# EAGLE design EM7180+LSM6DSM+LIS2MDL+LPS22HD.v01a (EAGLE 7.7.0)
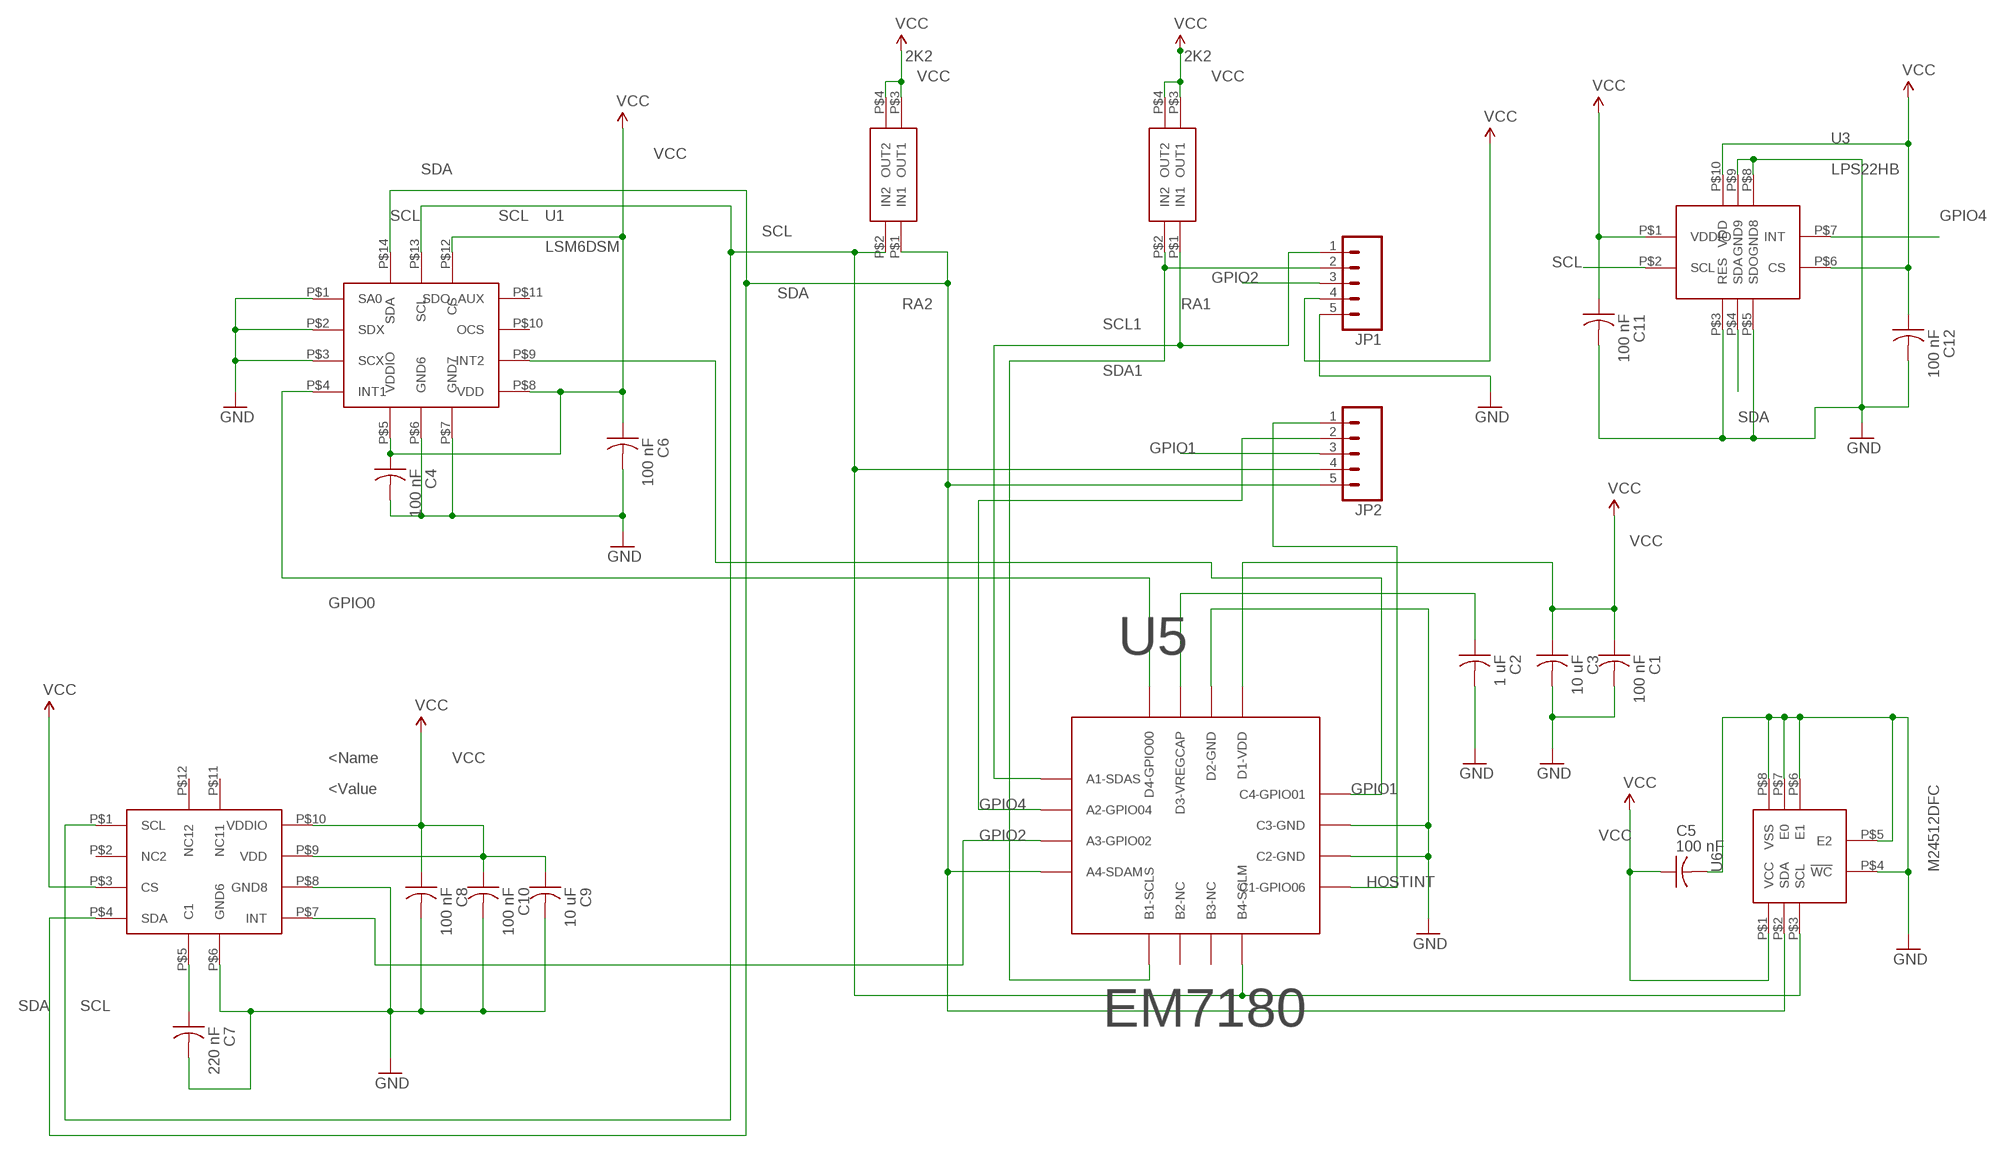
[diagram p0: schematic, sheet 1]

## Parts
C1  100 nF  C-US  [C0402_B]
C2  1 uF  C-US  [C0402_B]
C3  10 uF  C-US  [C0402_B]
C4  100 nF  C-US  [C0402_B]
C5  100 nF  C-US  [C0402_B]
C6  100 nF  C-US  [C0402_B]
C7  220 nF  C-US  [C0402_B]
C8  100 nF  C-US  [C0402_B]
C9  10 uF  C-US  [C0402_B]
C10  100 nF  C-US  [C0402_B]
C11  100 nF  C-US  [C0402_B]
C12  100 nF  C-US  [C0402_B]
JP1  M05NO_SILK  [1X05_NO_SILK]
JP2  M05NO_SILK  [1X05_NO_SILK]
RA1  2K2  EXB24V  [EXB24V]
RA2  2K2  EXB24V  [EXB24V]
U1  LSM6DSM  [LSM6DSM]
U2  LIS2MDL  [LIS2MDL]
U3  LPS22HB  [LPS22HB]
U5  EM7180  [WL-CSP16]
U6  M24512DFC  [M24512DFC]

## Nets
GND: C1.2 C2.2 C3.2 C4.2 C5.2 C6.2 C7.2 C8.2 C9.2 C10.2 C11.2 C12.2 JP1.5 U1.P$1(SA0) U1.P$2(SDX) U1.P$3(SCX) U1.P$6(GND6) U1.P$7(GND7) U2.P$6(GND6) U2.P$8(GND8) U3.P$3(RES) U3.P$5(SDO) U3.P$8(GND8) U3.P$9(GND9) U5.P$10(C2-GND) U5.P$11(C3-GND) U5.P$14(D2-GND) U6.P$4(!WC) U6.P$5(E2) U6.P$6(E1) U6.P$7(E0) U6.P$8(VSS)
GPIO0: U1.P$4(INT1) U5.P$16(D4-GPIO00)
GPIO1: JP2.3 U1.P$9(INT2) U5.P$12(C4-GPIO01)
GPIO2: JP1.3 U2.P$7(INT) U5.P$3(A3-GPIO02)
GPIO4: JP2.2 U3.P$7(INT) U5.P$2(A2-GPIO04)
HOSTINT: JP2.1 U5.P$9(C1-GPIO06)
N$4: C7.1 U2.P$5(C1)
N$9: C2.1 U5.P$15(D3-VREGCAP)
SCL: JP2.4 RA2.P$2(IN2) U1.P$13(SCL) U2.P$1(SCL) U3.P$2(SCL) U5.P$8(B4-SCLM) U6.P$3(SCL)
SCL1: JP1.1 RA1.P$1(IN1) U5.P$1(A1-SDAS)
SDA: JP2.5 RA2.P$1(IN1) U1.P$14(SDA) U2.P$4(SDA) U3.P$4(SDA) U5.P$4(A4-SDAM) U6.P$2(SDA)
SDA1: JP1.2 RA1.P$2(IN2) U5.P$5(B1-SCLS)
VCC: C1.1 C3.1 C4.1 C5.1 C6.1 C8.1 C9.1 C10.1 C11.1 C12.1 JP1.4 RA1.P$3(OUT1) RA1.P$4(OUT2) RA2.P$3(OUT1) RA2.P$4(OUT2) U1.P$5(VDDIO) U1.P$8(VDD) U1.P$12(CS) U2.P$3(CS) U2.P$9(VDD) U2.P$10(VDDIO) U3.P$1(VDDIO) U3.P$6(CS) U3.P$10(VDD) U5.P$13(D1-VDD) U6.P$1(VCC)
Unconnected: U2.P$2(NC2) U2.P$11(NC11) U2.P$12(NC12) U5.P$6(B2-NC) U5.P$7(B3-NC)

## Power pins joined to a net without a drawn wire
OCS: U1.P$10(OCS)
SDO_AUX: U1.P$11(SDO_AUX)

## Library data of the parts
C1-C12 = Spark:C-US: Capacitor
JP1 JP2 = SparkFun-Connectors:M05: Header 5 Standard 5-pin 0.1" header. Use with straight break away headers (SKU : PRT-00116), right angle break away headers (PRT-00553), swiss pins (PRT-00743), machine pins (PRT-00117), and female headers (PRT-00115). Molex polarized connector foot print use with SKU : PRT-08230 with associated crimp pins and housings.
RA1 RA2 = Kris:EXB24V: Panasonic EXB24 22 Ohm series resistor pair
U1 = Kris:LSM6DSM: LSM6DSM ST accel/gyro
U2 = Kris:LIS2MDL: LIS2MDL ST magnetomneter
U3 = Kris:LPS22HB: LPS22HB ST pressure sensor http://www.st.com/content/ccc/resource/technical/document/datasheet/bf/c1/4f/23/61/17/44/8a/DM00140895.pdf/files/DM00140895.pdf/jcr:content/translations/en.DM00140895.pdf
U5 = SparkFun-DigitalIC:EM7180: WL-CSP19 package for the EM7180 SENtral sensor fusion hub
U6 = Kris:M24512DFC: ST's M24512DFC6 512 Mbit EEPROM

## Board
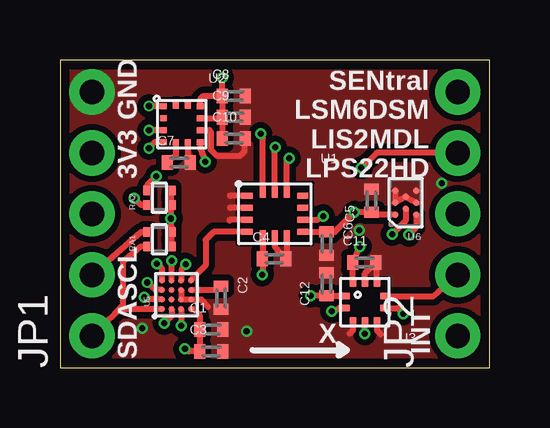
[diagram p1: board, top side]
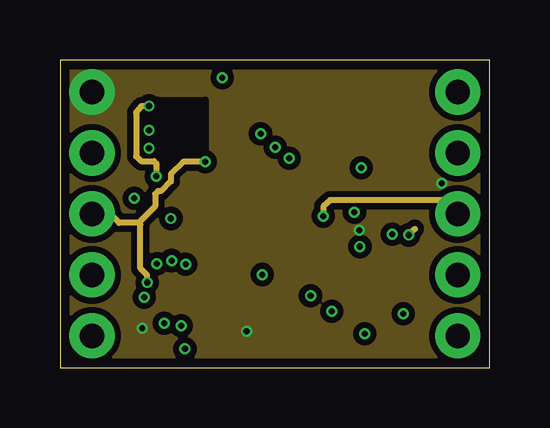
[diagram p2: board, inner layer Route2]
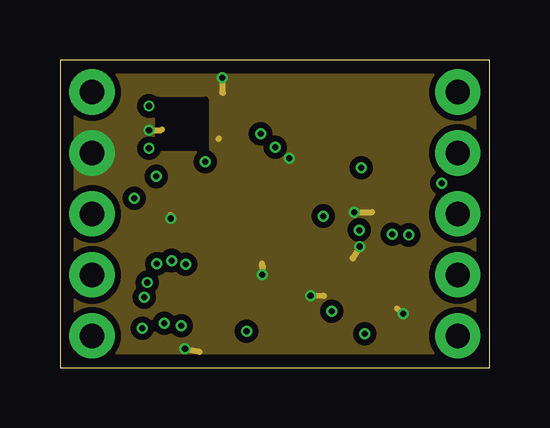
[diagram p3: board, inner layer Route15]
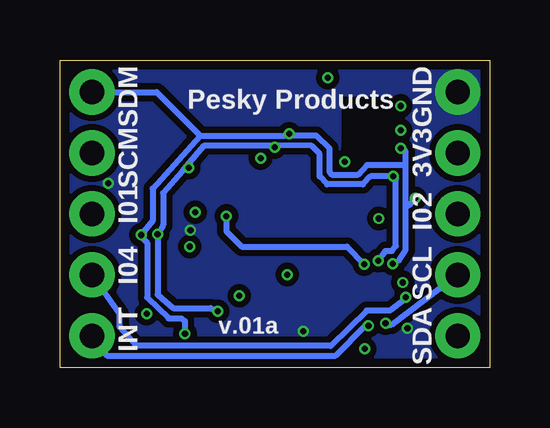
[diagram p4: board, bottom side, seen from below]

Size 17.91 x 12.83 mm. Coordinates in mm from the lower left corner, seen from the top.
Outline: 0,0 17.91,0 17.91,12.83 0,12.83 0,0
Copper layers (1*2*15*16): Top 0.035559375mm / dielectric 0.17018125mm / Route2 0.01778125mm / dielectric 47mil / Route15 0.01778125mm / dielectric 0.17018125mm / Bottom 0.035559375mm
Design rules "OSHPark-4layer *": minimum track width 5mil, minimum drill 10mil, track to track 5mil, track to pad 5mil, pad to pad 5mil, via to via 5mil, smd to smd 5mil, copper to edge 15mil, drill to drill 6mil, minimum pad ring 4mil, minimum via ring 4mil, stop-mask expansion 4mil, vias tented up to drill 20mil, thermal gap 10mil

### Footprints (pad centres in the part's own frame; a part is rotated, then mirrored left to right if it is on the bottom)
C0402_B = smd 0.457 x 0.61: 1 -0.483,0; 2 0.483,0
1X05_NO_SILK = drill 1.016 pad 1.88: 1 0,0; 2 2.54,0; 3 5.08,0; 4 7.62,0; 5 10.16,0
EXB24V = smd 0.4 x 0.36: P$1 -0.3,0.5; P$2 0.3,0.5; P$3 -0.3,-0.5; P$4 0.3,-0.5
LSM6DSM = smd 0.475 x 0.25: P$1 -1.163,0.75; P$2 -1.163,0.25; P$3 -1.163,-0.25; P$4 -1.163,-0.75; P$8 1.163,-0.75; P$9 1.163,-0.25; P$10 1.163,0.25; P$11 1.163,0.75 | smd 0.25 x 0.475: P$5 -0.5,-0.912; P$6 0,-0.912; P$7 0.5,-0.912; P$12 0.5,0.912; P$13 0,0.912; P$14 -0.5,0.912
LIS2MDL = smd 0.275 x 0.25: P$1 -0.765,0.75; P$2 -0.765,0.25; P$3 -0.765,-0.25; P$4 -0.765,-0.75; P$7 0.765,-0.75; P$8 0.765,-0.25; P$9 0.765,0.25; P$10 0.765,0.75 | smd 0.25 x 0.275: P$5 -0.25,-0.765; P$6 0.25,-0.765; P$11 0.25,0.765; P$12 -0.25,0.765
LPS22HB = smd 0.3 x 0.275: P$1 -0.787,0.25; P$2 -0.787,-0.25; P$6 0.787,-0.25; P$7 0.787,0.25 | smd 0.275 x 0.3: P$3 -0.5,-0.787; P$4 0,-0.787; P$5 0.5,-0.787; P$8 0.5,0.787; P$9 0,0.787; P$10 -0.5,0.787
WL-CSP16 = smd 0.24 x 0.24: P$1 -0.6,0.6; P$2 -0.2,0.6; P$3 0.2,0.6; P$4 0.6,0.6; P$5 -0.6,0.2; P$6 -0.2,0.2; P$7 0.2,0.2; P$8 0.6,0.2; P$9 -0.6,-0.2; P$10 -0.2,-0.2; P$11 0.2,-0.2; P$12 0.6,-0.2; P$13 -0.6,-0.6; P$14 -0.2,-0.6; P$15 0.2,-0.6; P$16 0.6,-0.6
M24512DFC = smd 0.27 x 0.27: P$1 0.433,0.5; P$2 -0.433,0.5; P$3 0,0.25; P$4 0.433,0; P$5 -0.433,0; P$6 0,-0.25; P$7 0.433,-0.5; P$8 -0.433,-0.5

### Placement (x,y rotation side)
C1  6.3,1.6 0 top
C2  6.71,2.92 270 top
C3  6.3,0.69 0 top
C4  8.92,4.55 0 top
C5  12.98,6.96 90 top
C6  11.1,5.18 270 top
C7  4.95,8.56 0 top
C8  7.24,11.33 0 top
C9  7.24,10.44 0 top
C10  7.24,9.55 0 top
C11  12.67,4.39 0 top
C12  11.1,3.48 90 top
JP1  1.33,1.33 90 top
JP2  16.57,1.33 90 top
RA1  4.14,5.36 90 top
RA2  4.14,7.09 90 top
U1  8.95,6.41 0 top
U2  5.08,10.16 0 top
U3  12.7,2.74 0 top
U5  4.85,3.05 90 top
U6  14.4,6.88 180 top

### Tracks (layer width: path | path; a pad name or v marks a point on that pad's centre or on a via)
GND  (via drill 0.25)
  Top 0.254: U5.P$11 U5.P$10 U5.P$14 5.89,2.85 6.17,2.54 | U6.P$7 U6.P$4 14.22,7.03 U6.P$6 14.66,6.98 U6.P$5 | U1.P$3 7.08,6.16 7.06,6.15 | U1.P$2 7.1,6.66 7.09,6.68 | U1.P$1 7.11,7.16 7.09,7.19 | U1.P$6 8.95,5.04 C4.2 9.45,4.6 U1.P$7 | U3.P$9 12.7,3.94 C11.2 13.2,4.35 U3.P$8 | U3.P$5 13.2,1.56 13.36,1.4 | U3.P$3 12.2,1.56 12.06,1.42 | U2.P$6 5.33,8.66 C7.2 | U2.P$8 6.22,9.91 6.27,9.86 6.27,9.09 6.53,8.84 7.52,8.84 7.7,9.02 7.7,9.53 C10.2
  other vias: 7.77,1.52 12.47,5.74 3.43,1.65 15.9,7.7
  pour Bottom (isolate 0.254, no thermals): 0,12.83 17.91,12.83 17.91,0 10.54,0 10.39,0 0.03,0
  pour Route2 (isolate 0.254, no thermals): 0,12.83 17.91,12.83 17.91,0 10.54,0 10.39,0 0.03,0
  pour Top (isolate 0.254, no thermals): 0,12.83 17.91,12.83 17.91,0.03 0,0
GPIO0
  Top 0.254: U1.P$4 6.4,5.66 6.07,5.33 6.07,4.27 U5.P$16
GPIO1  (via drill 0.25)
  Top 0.254: U1.P$9 10.71,6.16 v10.97,6.33 | v5.23,4.32 5.05,4.08 U5.P$12
  Route2 0.254: JP2.3 16.57,6.39 15.98,6.99 11.25,6.99 10.97,6.73 v10.97,6.33
  Bottom 0.254: v10.97,6.33 10.97,5.69 10.34,5.05 5.94,5.05 v5.23,4.32
GPIO2  (via drill 0.25)
  Top 0.254: U5.P$3 4.22,3.25 3.99,3.25 v3.63,3.56 | U2.P$7 5.84,9.14 v6.04,8.59
  Route2 0.254: JP1.3 1.35,6.4 2.11,6.4 2.46,6.04 3.28,6.04 | 3.28,6.04 3.96,6.73 3.96,7.24 4.09,7.37 4.22,7.37 4.62,7.77 4.62,8.08 5.13,8.59 v6.04,8.59 | v3.63,3.56 3.63,3.86 3.35,4.14 3.35,5.97 3.28,6.04
GPIO4  (via drill 0.25)
  Top 0.254: U3.P$7 15.57,2.99 JP2.2 | U5.P$2 3.68,2.85 v3.5,2.95
  Bottom 0.254: v3.5,2.95 3.56,2.85 4.17,2.39 5.13,2.39 6.63,0.91 14.73,0.91 15.42,1.7 15.42,2.26 JP2.2
HOSTINT  (via drill 0.25)
  Top 0.254: U5.P$9 5.05,1.93 v5.05,1.75
  Bottom 0.254: JP2.1 15.95,0.51 6.43,0.51 5.21,1.73 v5.05,1.75
N$1
  cutout Top (no thermals): 4.09,11.18 6.07,11.18 6.07,9.14 4.09,9.14 4.09,11.15
  cutout Route2 (no thermals): 4.09,11.18 6.07,11.18 6.07,9.14 4.09,9.14 4.09,11.15
  cutout Route15 (no thermals): 4.09,11.18 6.07,11.18 6.07,9.14 4.09,9.14 4.09,11.15
  cutout Bottom (no thermals): 4.09,11.18 6.07,11.18 6.07,9.14 4.09,9.14 4.09,11.15
N$3
  cutout Top: 11.71,3.73 13.69,3.73 13.69,1.78 11.71,1.78
N$4
  Top 0.254: U2.P$5 4.83,8.87 C7.1
N$5
  cutout Top: 7.42,7.7 10.49,7.7 10.49,5.16 7.42,5.16
N$9
  Top 0.254: U5.P$15 6.45,3.25 C2.1
SCL  (via drill 0.25)
  Top 0.254: U5.P$8 4.65,4.21 v4.65,4.47 | U6.P$3 14.4,6.12 v13.84,5.56 | RA2.P$2 3.64,7.63 v4.01,7.98 | U1.P$13 8.95,9.18 v8.97,9.2 | v11.33,2.36 11.63,2.49 U3.P$2 | JP2.4 13.2,8.95 v12.55,8.33 | U2.P$1 v3.71,10.91
  Route2 0.254: 13.82,5.59 v13.84,5.56 | v3.71,10.91 3.39,10.91 3.17,10.64 3.17,8.81 3.38,8.61 3.91,8.61 4.01,8.51 v4.01,7.98
  Bottom 0.254: 12.62,8.42 12.8,8.21 13.61,7.29 13.61,5.94 v13.84,5.56 13.84,3.05 13.18,2.49 11.63,2.49 v11.33,2.36 | 12.62,8.42 11.89,9.27 9.07,9.27 v8.97,9.2 8.89,9.27 7.42,9.25 7.09,8.91 7.09,7.98 6.78,7.64 5.28,7.64 4.98,7.98 v4.01,7.98 3.91,7.87 3.91,5.08 4.06,4.88 4.34,4.88 v4.65,4.47 | v12.55,8.33 12.57,8.36 12.62,8.42
SCL1
  Top 0.254: JP1.1 1.93,1.93 2.26,2.23 | RA1.P$1 3.33,5.04 2.62,4.42 2.62,2.62 2.26,2.23 | U5.P$1 2.47,2.45 2.26,2.23
SDA  (via drill 0.25)
  Top 0.254: U5.P$4 4.25,4.13 4.09,4.34 v4.04,4.34 3.98,4.4 | U6.P$2 14.84,5.87 v14.53,5.54 | RA2.P$1 3.46,6.79 3.38,6.78 v3.1,7.06 | U1.P$14 8.45,9.58 v8.36,9.75 | U2.P$4 3.95,9.41 v3.71,9.14 | v12.7,1.42 U3.P$4
  Route2 0.254: 14.78,5.79 v14.53,5.54
  Bottom 0.254: 12.06,9.68 14.05,7.47 14.05,6.12 v14.53,5.54 14.53,5.46 14.28,5.21 14.28,2.92 13.39,2.06 12.85,2.06 U3.P$4 v12.7,1.42 | 12.06,9.68 8.53,9.68 v8.36,9.75 8.18,9.68 7.24,9.68 6.68,9.14 6.68,8.18 6.58,8.05 5.49,8.05 5.11,8.46 3.61,8.46 3.5,8.51 | v4.04,4.34 3.79,4.47 3.5,4.9 3.5,6.78 | 3.5,6.78 3.5,8.51 | 3.5,8.51 3.5,9.02 3.62,9.14 v3.71,9.14 | 3.5,6.78 3.35,6.78 v3.1,7.06 | JP2.5 13.88,11.49 12.06,9.68
SDA1  (via drill 0.25)
  Top 0.254: U5.P$5 4.65,2.16 v4.34,1.85 | RA1.P$2 3.37,5.66 JP1.2
  Bottom 0.254: v4.34,1.85 4.27,1.8 4.09,1.8 JP1.2
VCC  (via drill 0.25)
  Top 0.254: U6.P$1 13.07,6.38 C5.1 v12.27,6.48 11.46,5.66 C6.1 U1.P$8 | RA1.P$3 RA1.P$4 4.64,5.88 v4.62,6.22 4.62,6.48 RA2.P$3 RA2.P$4 | v5.21,0.79 5.38,0.69 C3.1 C1.1 5.82,2.18 5.55,2.45 U5.P$13 | U1.P$12 9.45,8.64 v9.55,8.74 | 8.45,4.58 8.45,3.97 v8.43,3.89 | U1.P$5 8.45,4.58 | 8.45,4.58 C4.1 | U2.P$9 6.58,10.41 C9.1 | C9.1 C10.1 | U2.P$3 v3.71,9.91 | C8.1 C9.1 | v10.44,3 C12.1 U3.P$1 | v12.5,5.05 C11.1 U3.P$10 | U3.P$6 14.07,2.49 v14.3,2.26 | C8.1 v6.76,12.09 | U2.P$10 5.84,11.2 5.97,11.33 C8.1
  Top 0.406: 1.74,9.36 JP1.4
  Route15 0.254: 4.6,6.38 v4.62,6.22 | v5.21,0.79 5.79,0.69 5.82,0.66 | v12.27,6.48 C5.1 13.01,6.5 | v9.55,8.74 9.53,8.74 9.5,8.71 | v8.43,3.89 8.46,4.22 8.41,4.34 | 6.6,9.53 6.63,9.55 | v3.71,9.91 4.22,9.91 4.24,9.93 | v10.44,3 10.97,3.02 11,3 | v12.5,5.05 12.19,4.57 12.22,4.55 | v14.3,2.26 14.25,2.26 14.05,2.46 | v6.76,12.09 6.76,11.48 6.78,11.46
  pour Route15 (isolate 0.254, no thermals): 0.64,12.19 17.27,12.19 17.27,0.64 10.54,0.64 10.52,0.64 0.64,0.64

### Text on the board
tPlace: SENtral / LSM6DSM / LIS2MDL / LPS22HD | GND | 3V3 | SCL | INT | X | SDA
bPlace: GND | SDM | Pesky Products | 3V3 | SCM | I01 | I02 | SCL | I04 | SDA | INT | v.01a